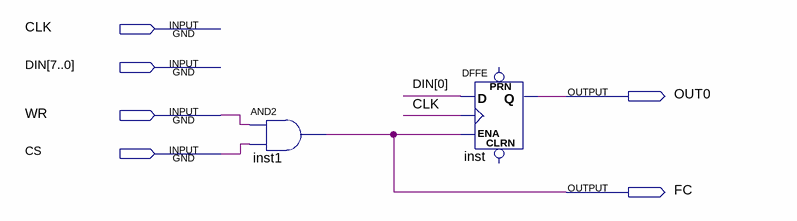
[diagram p0: schematic sheet]
// Quartus schematic OUT0_Bypass.bdf as structural Verilog: 2 symbols, 6 pins
module OUT0_Bypass (
  input  CLK,
  input  [7:0] DIN,
  input  WR,
  input  CS,
  output OUT0,
  output FC
);

  and inst1 (FC, WR, CS);
  DFFE inst (.D(DIN[0]), .CLK(CLK), .ENA(FC), .Q(OUT0));  // open: PRN, CLRN
endmodule
